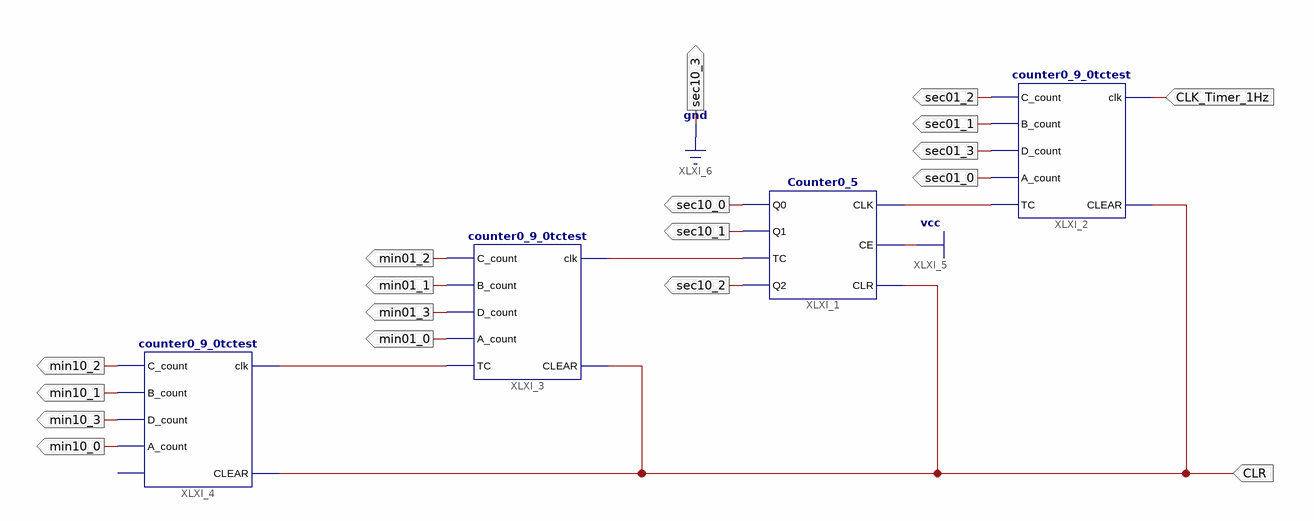
[diagram p0: schematic sheet 1]
// Xilinx ISE schematic Time_Counter.sch (spartan6) as structural Verilog: 4 symbols, 18 ports
module Time_Counter (
  input  CLR,
  input  CLK_Timer_1Hz,
  output sec01_2,
  output sec01_1,
  output sec01_3,
  output sec01_0,
  output sec10_0,
  output sec10_1,
  output sec10_2,
  output sec10_3,
  output min01_2,
  output min01_1,
  output min01_3,
  output min01_0,
  output min10_0,
  output min10_3,
  output min10_1,
  output min10_2
);

  wire XLXN_1, XLXN_2, XLXN_3;

  Counter0_5 XLXI_1 (.CLK(XLXN_1), .CE(1'b1), .CLR(CLR), .Q0(sec10_0), .Q1(sec10_1), .TC(XLXN_2), .Q2(sec10_2));
  counter0_9_0tctest XLXI_2 (
    .clk(CLK_Timer_1Hz), .CLEAR(CLR), .C_count(sec01_2), .B_count(sec01_1), .D_count(sec01_3),
    .A_count(sec01_0), .TC(XLXN_1));
  counter0_9_0tctest XLXI_3 (
    .clk(XLXN_2), .CLEAR(CLR), .C_count(min01_2), .B_count(min01_1), .D_count(min01_3), .A_count(min01_0),
    .TC(XLXN_3));
  counter0_9_0tctest XLXI_4 (
    .clk(XLXN_3), .CLEAR(CLR), .C_count(min10_2), .B_count(min10_1), .D_count(min10_3), .A_count(min10_0));  // open: TC

  assign sec10_3 = 1'b0;
endmodule
